# Altium project PCB_Project.PrjPcb
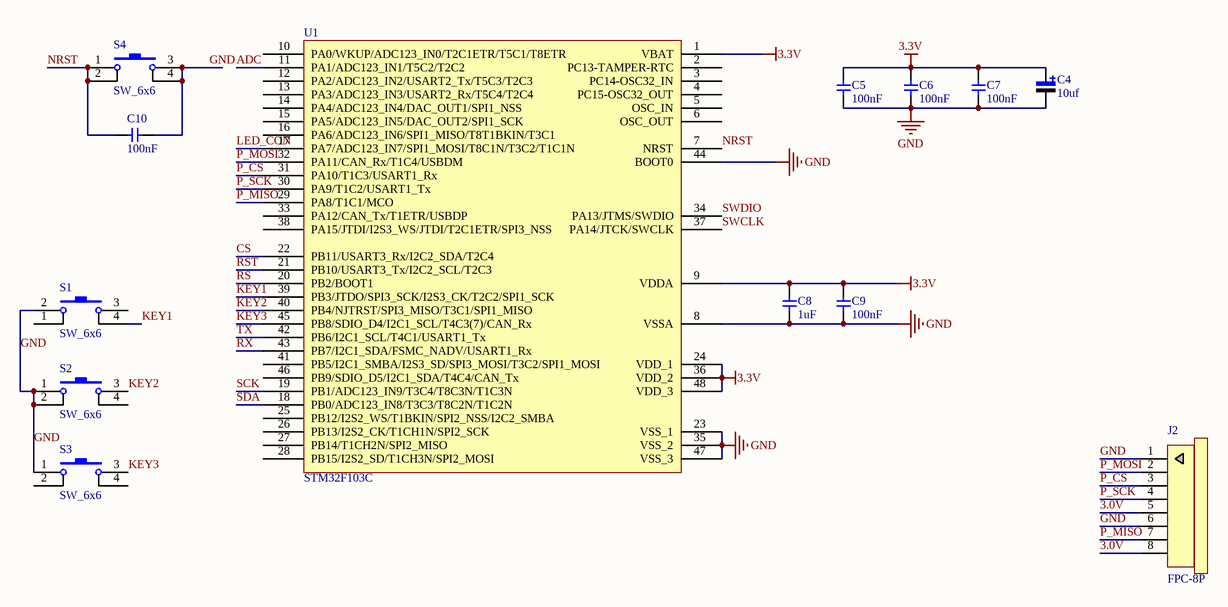
[diagram p0: 主控.SchDoc]
3 sheets, 34 parts. Net scope: global (net labels, ports and power ports of the same name join across sheets).
Board file: PCB1.PcbDoc
Sheets:
  主控.SchDoc
  电源.SchDoc
  LCD.SchDoc

## Sheet 主控.SchDoc
size A4

### Parts
C4  value 10uf  [CAP-3216]  (hidden comment: Cap Pol)
C5  value 100nF  [0603-2]  (hidden comment: Cap)
C6  value 100nF  [0603-2]  (hidden comment: Cap)
C7  value 100nF  [0603-2]  (hidden comment: Cap)
C8  value 1uF  [0603-2]  (hidden comment: Cap)
C9  value 100nF  [0603-2]  (hidden comment: Cap)
C10  value 100nF  [0805-2]  (hidden comment: Cap)
J2  FPC-8P  [FPC0.5-8P-C]
S1  SW_6x6  [button_6x6]
S2  SW_6x6  [button_6x6]
S3  SW_6x6  [button_6x6]
S4  SW_6x6  [button_6x6]
U1  STM32F103C  [LQFP-48_M]

### Nets
3.0V: J2.5 J2.8
3.3V: C4.1 C5.1 C6.1 C7.1 C8.2 C9.2 U1.1(VBAT) U1.9(VDDA) U1.24(VDD_1) U1.36(VDD_2) U1.48(VDD_3)
GND: C4.2 C5.2 C6.2 C7.2 C8.1 C9.1 C10.2 J2.1 J2.6 S1.2 S2.1 S2.2 S3.1 S4.3 S4.4 U1.8(VSSA) U1.23(VSS_1) U1.35(VSS_2) U1.44(BOOT0) U1.47(VSS_3)
ADC: U1.11(PA1/ADC123_IN1/T5C2/T2C2)
CS: U1.22(PB11/USART3_Rx/I2C2_SDA/T2C4)
KEY1: S1.4 U1.39(PB3/JTDO/SPI3_SCK/I2S3_CK/T2C2/SPI1_SCK)
KEY2: S2.3 U1.40(PB4/NJTRST/SPI3_MISO/T3C1/SPI1_MISO)
KEY3: S3.3 U1.45(PB8/SDIO_D4/I2C1_SCL/T4C3(7)/CAN_Rx)
LED_CON: U1.17(PA7/ADC123_IN7/SPI1_MOSI/T8C1N/T3C2/T1C1N)
NRST: C10.1 S4.1 S4.2 U1.7(NRST)
P_CS: J2.3 U1.31(PA10/T1C3/USART1_Rx)
P_MISO: J2.7 U1.29(PA8/T1C1/MCO)
P_MOSI: J2.2 U1.32(PA11/CAN_Rx/T1C4/USBDM)
P_SCK: J2.4 U1.30(PA9/T1C2/USART1_Tx)
RS: U1.20(PB2/BOOT1)
RST: U1.21(PB10/USART3_Tx/I2C2_SCL/T2C3)
RX: U1.43(PB7/I2C1_SDA/FSMC_NADV/USART1_Rx)
SCK: U1.19(PB1/ADC123_IN9/T3C4/T8C3N/T1C3N)
SDA: U1.18(PB0/ADC123_IN8/T3C3/T8C2N/T1C2N)
SWCLK: U1.37(PA14/JTCK/SWCLK)
SWDIO: U1.34(PA13/JTMS/SWDIO)
TX: U1.42(PB6/I2C1_SCL/T4C1/USART1_Tx)

Not connected (* = marked no-connect by the designer): S1 1 3; S2 4; S3 2 4; U1 2(PC13-TAMPER-RTC) 3(PC14-OSC32_IN) 4(PC15-OSC32_OUT) 5(OSC_IN) 6(OSC_OUT) 10(PA0/WKUP/ADC123_IN0/T2C1ETR/T5C1/T8ETR) 12(PA2/ADC123_IN2/USART2_Tx/T5C3/T2C3) 13(PA3/ADC123_IN3/USART2_Rx/T5C4/T2C4) 14(PA4/ADC123_IN4/DAC_OUT1/SPI1_NSS) 15(PA5/ADC123_IN5/DAC_OUT2/SPI1_SCK) 16(PA6/ADC123_IN6/SPI1_MISO/T8T1BKIN/T3C1) 25(PB12/I2S2_WS/T1BKIN/SPI2_NSS/I2C2_SMBA) 26(PB13/I2S2_CK/T1CH1N/SPI2_SCK) 27(PB14/T1CH2N/SPI2_MISO) 28(PB15/I2S2_SD/T1CH3N/SPI2_MOSI) 33(PA12/CAN_Tx/T1ETR/USBDP) 38(PA15/JTDI/I2S3_WS/JTDI/T2C1ETR/SPI3_NSS) 41(PB5/I2C1_SMBA/I2S3_SD/SPI3_MOSI/T3C2/SPI1_MOSI) 46(PB9/SDIO_D5/I2C1_SDA/T4C4/CAN_Tx)

### Library data of the parts
C4 = Cap Pol: 极性电解电容; Vol: 16V; Published: 8-Jun-2000; LatestRevisionDate: 17-Jul-2002; LatestRevisionNote: Re-released for DXP Platform.; PackageReference: RB7.6-15; Publisher: Altium Limited
C5-C10 = Cap: 无极性电容; Published: 8-Jun-2000; LatestRevisionDate: 17-Jul-2002; LatestRevisionNote: Re-released for DXP Platform.; PackageReference: RAD-0.3; Publisher: Altium Limited
J2 = FPC-8P: FPC排线连接器
S1-S4 = button_6x6: 轻触开关
U1 = STM32F103C: STM32单片机48引脚

## Sheet 电源.SchDoc
size A4
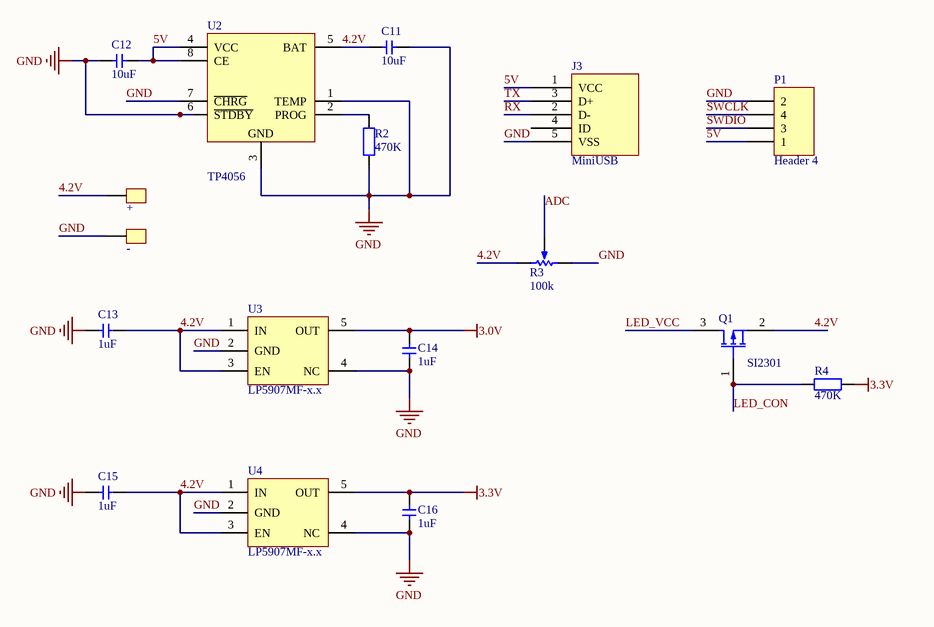
[diagram p1: 电源.SchDoc]

### Parts
+  pad  [pad_3x3]  (value not drawn)
-  pad  [pad_3x3]  (value not drawn)
C11  value 10uF  [0805-2]  (hidden comment: Cap)
C12  value 10uF  [0805-2]  (hidden comment: Cap)
C13  value 1uF  [0805-2]  (hidden comment: Cap)
C14  value 1uF  [0805-2]  (hidden comment: Cap)
C15  value 1uF  [0805-2]  (hidden comment: Cap)
C16  value 1uF  [0805-2]  (hidden comment: Cap)
J3  MiniUSB  [MINI USB]
P1  Header 4  [HDR1X4]
Q1  SI2301  [SOT-23]
R2  value 470K  [0805-2]  (hidden comment: Res1)
R3  value 100k  [3362P]  (hidden comment: 3362)
R4  value 470K  [0805-2]  (hidden comment: Res1)
U2  TP4056  [SOP-8-PP]
U3  LP5907MF-x.x  [SOT-23-5]
U4  LP5907MF-x.x  [SOT-23-5]

### Nets
3.0V: C14.2 U3.5(OUT)
3.3V: C16.2 R4.1 U4.5(OUT)
GND: -.1 C11.1 C12.2 C13.2 C14.1 C15.2 C16.1 J3.5(VSS) P1.2 R2.1 R3.1(TOP) U2.1(TEMP) U2.3(GND) U2.6(~{STDBY}) U2.7(~{CHRG}) U3.2(GND) U3.4(NC) U4.2(GND) U4.4(NC)
4.2V: +.1 C11.2 C13.1 C15.1 Q1.2(S) R3.3(BOT) U2.5(BAT) U3.1(IN) U3.3(EN) U4.1(IN) U4.3(EN)
5V: C12.1 J3.1(VCC) P1.1 U2.4(VCC) U2.8(CE)
ADC: R3.2(TAP)
LED_CON: Q1.1(G) R4.2
LED_VCC: Q1.3(D)
RX: J3.2(D-)
SWCLK: P1.4
SWDIO: P1.3
TX: J3.3(D+)
NetR2_2: R2.2 U2.2(PROG)

Not connected (* = marked no-connect by the designer): J3 4(ID)

### Library data of the parts
+ - = pad_3x3: 焊盘接口
C11-C16 = Cap: 无极性电容; Published: 8-Jun-2000; LatestRevisionDate: 17-Jul-2002; LatestRevisionNote: Re-released for DXP Platform.; PackageReference: RAD-0.3; Publisher: Altium Limited
J3 = MiniUSB: MiniUSB母座
P1 = Header 4: Header, 4-Pin; LatestRevisionDate: 17-Jul-2002; LatestRevisionNote: Re-released for DXP Platform.; Publisher: Altium Limited
Q1 = SI2301: PMOS
R2 R4 = Res1: 贴片电阻; Published: 8-Jun-2000; LatestRevisionDate: 17-Jul-2002; LatestRevisionNote: Re-released for DXP Platform.; PackageReference: AXIAL-0.4; Publisher: Altium Limited
R3 = 3362: 精密可调单圈电阻器
U2 = TP4056: 锂电池充电管理
U3 U4 = LP5907MF-x.x: LDO线性稳压器

## Sheet LCD.SchDoc
size A4
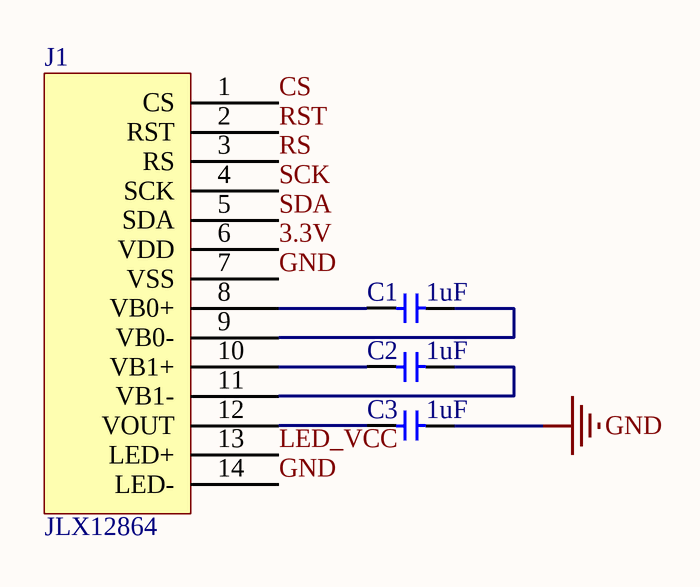
[diagram p2: LCD.SchDoc]

### Parts
C1  value 1uF  [0603-2]  (hidden comment: Cap)
C2  value 1uF  [0603-2]  (hidden comment: Cap)
C3  value 1uF  [0603-2]  (hidden comment: Cap)
J1  JLX12864  [JLX12864]

### Nets
3.3V: J1.6(VDD)
GND: C3.2 J1.7(VSS) J1.14(LED-)
CS: J1.1(CS)
LED_VCC: J1.13(LED+)
RS: J1.3(RS)
RST: J1.2(RST)
SCK: J1.4(SCK)
SDA: J1.5(SDA)
NetC1_1: C1.1 J1.8(VB0+)
NetC1_2: C1.2 J1.9(VB0-)
NetC2_1: C2.1 J1.10(VB1+)
NetC2_2: C2.2 J1.11(VB1-)
NetC3_1: C3.1 J1.12(VOUT)

### Library data of the parts
C1-C3 = Cap: 无极性电容; Published: 8-Jun-2000; LatestRevisionDate: 17-Jul-2002; LatestRevisionNote: Re-released for DXP Platform.; PackageReference: RAD-0.3; Publisher: Altium Limited
J1 = JLX12864: 12864点阵屏

## Nets that join several sheets
3.0V: 主控 (J2.5 J2.8), 电源 (C14.2 U3.5)
3.3V: 主控 (11 pins), 电源 (C16.2 R4.1 U4.5), LCD (J1.6)
GND: 主控 (20 pins), 电源 (19 pins), LCD (C3.2 J1.7 J1.14)
ADC: 主控 (U1.11), 电源 (R3.2)
CS: 主控 (U1.22), LCD (J1.1)
LED_CON: 主控 (U1.17), 电源 (Q1.1 R4.2)
LED_VCC: 电源 (Q1.3), LCD (J1.13)
RS: 主控 (U1.20), LCD (J1.3)
RST: 主控 (U1.21), LCD (J1.2)
RX: 主控 (U1.43), 电源 (J3.2)
SCK: 主控 (U1.19), LCD (J1.4)
SDA: 主控 (U1.18), LCD (J1.5)
SWCLK: 主控 (U1.37), 电源 (P1.4)
SWDIO: 主控 (U1.34), 电源 (P1.3)
TX: 主控 (U1.42), 电源 (J3.3)